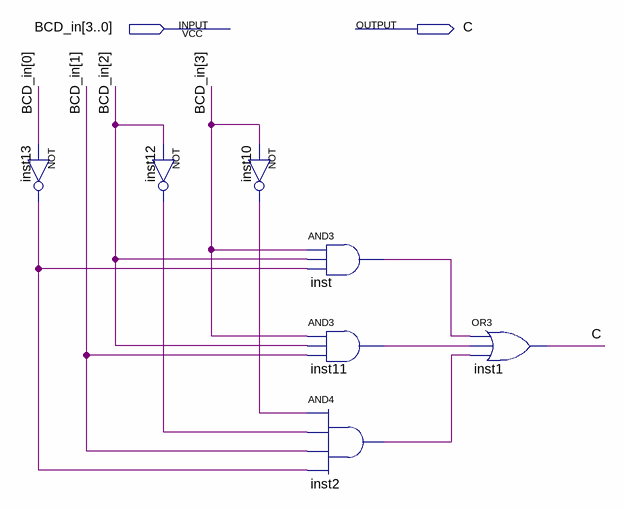
[diagram p0: schematic sheet]
// Quartus schematic C.bdf as structural Verilog: 7 symbols, 2 pins
module C (
  input  [3:0] BCD_in,
  output C
);

  wire inst2_out, inst10_out, inst11_out, inst12_out, inst13_out, inst_out;

  not inst13 (inst13_out, BCD_in[0]);
  not inst12 (inst12_out, BCD_in[2]);
  not inst10 (inst10_out, BCD_in[3]);
  and inst (inst_out, BCD_in[3], BCD_in[2], inst13_out);
  and inst11 (inst11_out, BCD_in[3], BCD_in[2], BCD_in[1]);
  and inst2 (inst2_out, inst10_out, inst12_out, BCD_in[1], inst13_out);
  or inst1 (C, inst_out, inst11_out, inst2_out);
endmodule
